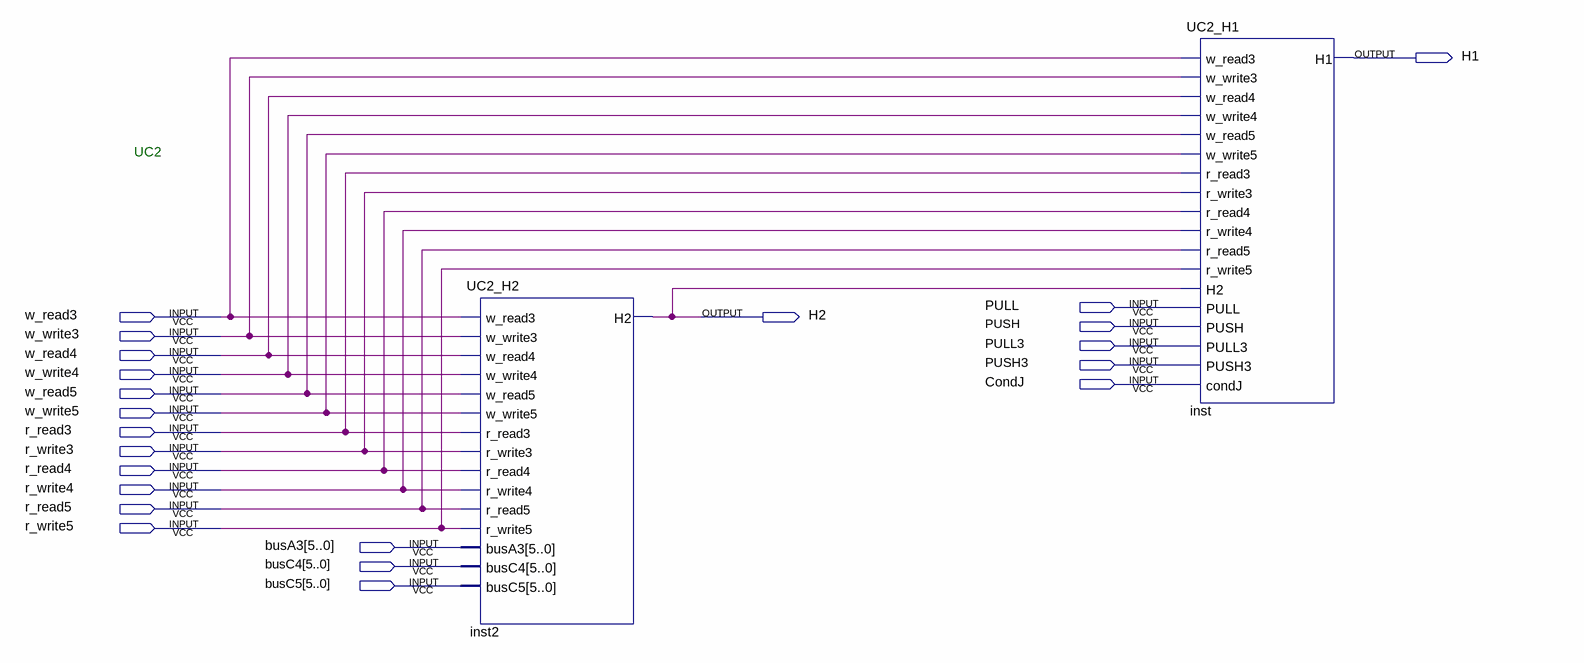
[diagram p0: schematic sheet]
// Quartus schematic UC2_BLOCK.bdf as structural Verilog: 2 symbols, 22 pins
module UC2_BLOCK (
  input  PULL,
  input  w_read3,
  input  PUSH,
  input  w_write3,
  input  PULL3,
  input  w_read4,
  input  PUSH3,
  input  w_write4,
  input  CondJ,
  input  w_read5,
  input  w_write5,
  input  r_read3,
  input  r_write3,
  input  r_read4,
  input  r_write4,
  input  r_read5,
  input  r_write5,
  input  [5:0] busA3,
  input  [5:0] busC4,
  input  [5:0] busC5,
  output H1,
  output H2
);

  UC2_H2 inst2 (
    .w_read3(w_read3), .w_write3(w_write3), .w_read4(w_read4), .w_write4(w_write4), .w_read5(w_read5),
    .w_write5(w_write5), .r_read3(r_read3), .r_write3(r_write3), .r_read4(r_read4), .r_write4(r_write4),
    .r_read5(r_read5), .r_write5(r_write5), .busA3(busA3), .busC4(busC4), .busC5(busC5), .H2(H2));
  UC2_H1 inst (
    .w_read3(w_read3), .w_write3(w_write3), .w_read4(w_read4), .w_write4(w_write4), .w_read5(w_read5),
    .w_write5(w_write5), .r_read3(r_read3), .r_write3(r_write3), .r_read4(r_read4), .r_write4(r_write4),
    .r_read5(r_read5), .r_write5(r_write5), .H2(H2), .PULL(PULL), .PUSH(PUSH), .PULL3(PULL3), .PUSH3(PUSH3),
    .condJ(CondJ), .H1(H1));

  // Notes on the sheet:
  //   UC2
endmodule
